# EAGLE design Add-OnV11 (EAGLE 6.3)
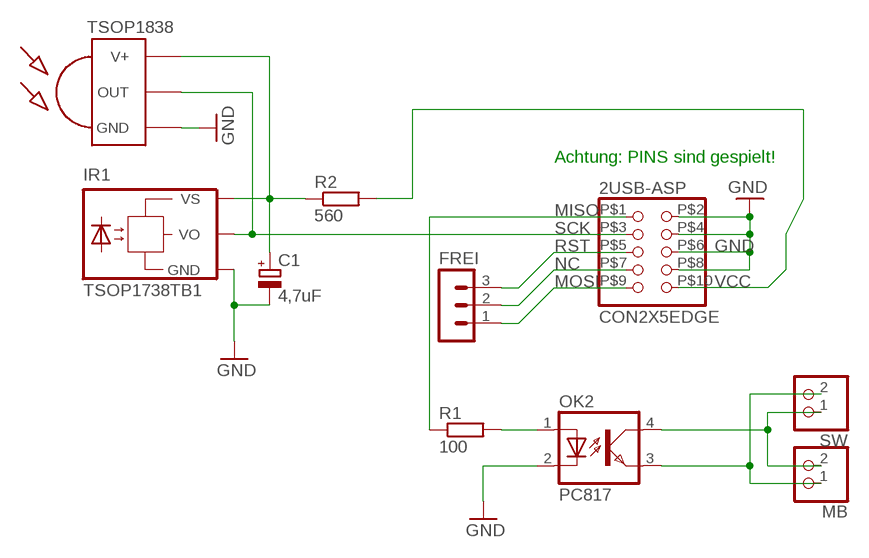
[diagram p0: schematic, sheet 1]

## Parts
2USB-ASP  CON2X5EDGE  [CON2X5EDGE]
C1  4,7uF  CPOL-EUE1.8-4  [E1,8-4]
FREI  MA03-1  [MA03-1]
IR1  TSOP1738TB1  [TSOP17_TB1]
MB  PINHD-1X2  [1X02]
OK2  PC817  [DIL04]
R1  100  R-EU_0204/2V  [0204V]
R2  560  R-EU_0204/2V  [0204V]
SW  PINHD-1X2  [1X02]
U$1  TSOP1838  [TSOP18XX]

## Nets
GND: 2USB-ASP.P$2 2USB-ASP.P$4 2USB-ASP.P$6 2USB-ASP.P$8 C1.- IR1.GND OK2.2(C) U$1.GND
MISO: 2USB-ASP.P$1 R1.1
MOSI: 2USB-ASP.P$9 FREI.1
N$1: C1.+ IR1.VS R2.1 U$1.VCC(V+)
N$2: OK2.1(A) R1.2
N$3: MB.2 OK2.4(COL) SW.1
N$4: MB.1 OK2.3(EMIT) SW.2
NC: 2USB-ASP.P$7 FREI.2
RST: 2USB-ASP.P$5 FREI.3
SCK: 2USB-ASP.P$3 IR1.VO U$1.OUT
VCC: 2USB-ASP.P$10 R2.2

## Notes on the sheet
- Achtung: PINS sind gespielt!

## Library data of the parts
2USB-ASP = schwen:CON2X5EDGE
C1 = rcl:CPOL-EU: POLARIZED CAPACITOR, European symbol
FREI = con-lstb:MA03-1: PIN HEADER; OC_FARNELL: unknown; OC_NEWARK: unknown
IR1 = telefunken:TSOP17*TB1: TSOP17..TB1 IR Receiver Modules for Remote Control Systems Source: http://www.vishay.com/docs/82042/82042.pdf; OC_FARNELL: unknown; OC_NEWARK: unknown
MB SW = pinhead:PINHD-1X2: PIN HEADER
OK2 = optocoupler:PC817: SHARP OPTO COUPLER; MPN: PC817X4J000F; OC_FARNELL: 9707727; OC_NEWARK: 97K7059
R1 R2 = rcl:R-EU_: RESISTOR, European symbol
U$1 = tsop-1:TSOP1838: IR Receiver and Demodulator

## Board
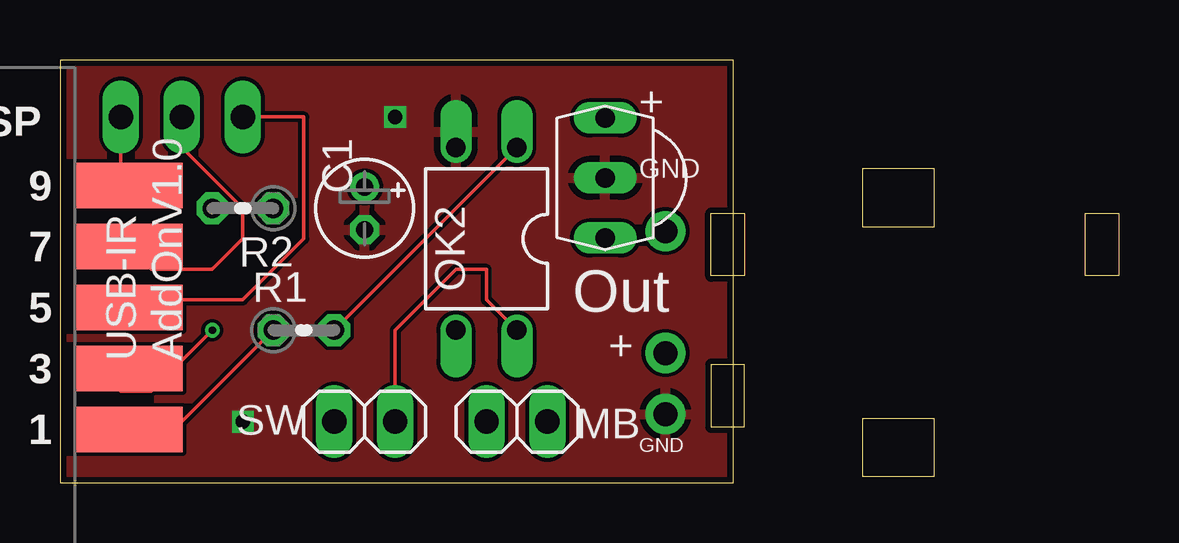
[diagram p1: board, top side]
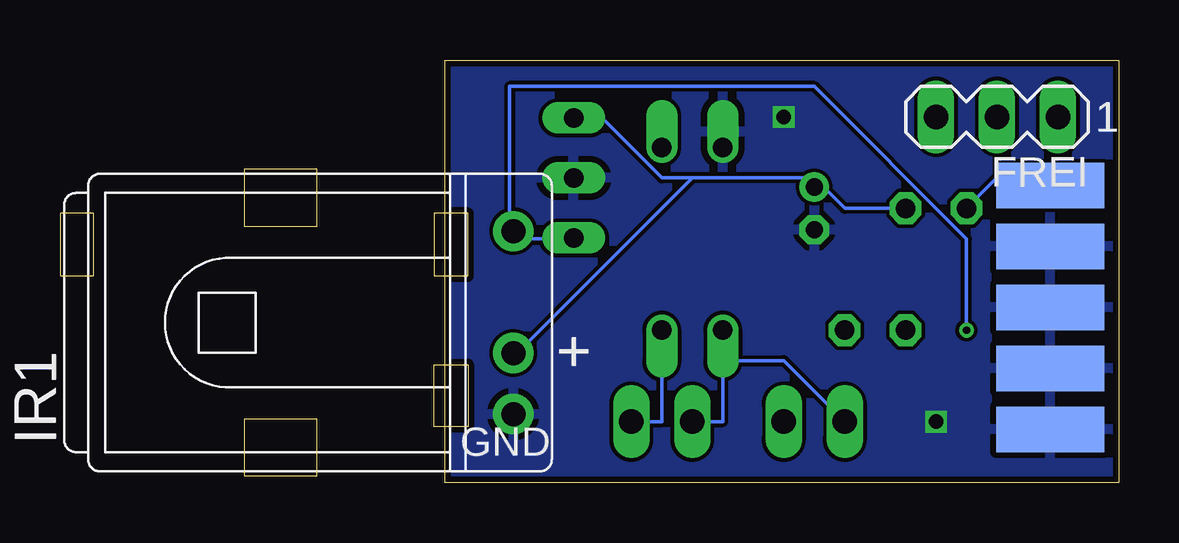
[diagram p2: board, bottom side, seen from below]

Size 28.08 x 17.61 mm. Coordinates in mm from the lower left corner, seen from the top.
Outline: 0,0 28.08,0 28.08,17.61 0,17.61 0,0
Copper layers (1*16): Top 0.035mm / dielectric 1.5mm / Bottom 0.035mm
Design rules "Fusion_eagle_rule_v1.1": minimum track width 6mil, minimum drill 12mil, track to track 6mil, track to pad 6mil, pad to pad 6mil, via to via 6mil, smd to smd 0mil, copper to edge 10mil, drill to drill 10mil, minimum pad ring 10mil, minimum via ring 6mil, stop-mask expansion 2mil, vias tented up to drill 100mil, thermal gap 10mil

### Footprints (pad centres in the part's own frame; a part is rotated, then mirrored left to right if it is on the bottom)
CON2X5EDGE = smd 4.5 x 1.9: P$1 0,5.08; P$3 0,2.54; P$5 0,0; P$7 0,-2.54; P$9 0,-5.08 | smd 4.5 x 1.9 bottom: P$2 0,5.08; P$4 0,2.54; P$6 0,0; P$8 0,-2.54; P$10 0,-5.08
E1,8-4 = drill 0.711 pad 1.168: + -0.889,0 | drill 0.711 pad 1.168 octagon: - 0.889,0
MA03-1 = drill 1.016 long: 1 -2.54,0; 2 0,0; 3 2.54,0
TSOP17_TB1 = drill 1 pad 1.676: GND 0,-3.81; VO 0,3.81; VS 0,-1.27
1X02 = drill 1.016 long: 1 -1.27,0; 2 1.27,0
DIL04 = drill 0.813 offset: 1 -1.27,-3.81; 2 1.27,-3.81; 3 1.27,3.81; 4 -1.27,3.81
0204V = drill 0.813 octagon: 1 -1.27,0; 2 1.27,0
TSOP18XX = drill 0.813 long: GND -0.001,-0.027; OUT -2.501,-0.027; VCC 2.499,-0.027

### Placement (x,y rotation side)
2USB-ASP  2.86,7.3 180 top
C1  12.7,11.43 270 top
FREI  5.08,15.24 180 bottom
IR1  25.24,6.67 0 bottom
MB  19.05,2.54 0 top
OK2  17.78,10.16 180 top
R1  10.16,6.35 0 top
R2  7.62,11.43 180 top
SW  12.7,2.54 180 top
U$1  22.7,12.7 90 top

### Tracks (layer width: path | path; a pad name or v marks a point on that pad's centre or on a via)
GND  (via drill 0.6)
  other vias: 13.97,15.24 7.62,2.54
  pour Bottom: 0,17.78 0,0 27.94,0 27.94,17.78
  pour Top: 0,17.78 27.94,17.78 27.94,0 0,0
MISO
  Top 0.152: R1.1 5.08,2.54 3.81,2.54 2USB-ASP.P$1
MOSI
  Top 0.152: FREI.1 2.54,12.7 2USB-ASP.P$9
N$1
  Bottom 0.152: 12.7,12.7 11.43,11.43 R2.1 | 12.7,12.7 17.78,12.7 | 17.78,12.7 19.05,12.7 21.59,15.24 U$1.VCC | 12.7,12.7 C1.+ | 17.78,12.7 25.4,5.08 IR1.VS
N$2
  Top 0.152: OK2.1 R1.2
N$3
  Top 0.152: SW.1 13.97,6.35 16.51,8.89 17.78,8.89 17.78,7.62 OK2.4
  Bottom 0.152: OK2.4 19.05,2.54 MB.2
N$4
  Bottom 0.152: 16.51,5.08 16.51,2.54 MB.1 | SW.2 13.97,5.08 16.51,5.08 | 16.51,5.08 OK2.3
NC
  Top 0.152: FREI.2 5.08,13.97 7.62,11.43 7.62,10.16 6.35,8.89 3.81,8.89 3.81,10.16 2USB-ASP.P$7
RST
  Top 0.152: FREI.3 10.16,15.24 10.16,10.16 7.62,7.62 3.81,7.62 2USB-ASP.P$5
SCK  (via drill 0.3)
  Top 0.152: v6.35,6.35 3.81,3.81 2.54,3.81 2.54,5.08 2USB-ASP.P$3
  Bottom 0.152: 25.4,10.16 22.86,10.16 U$1.OUT | 25.4,10.16 25.4,16.51 12.7,16.51 6.35,10.16 v6.35,6.35 | 25.4,10.16 IR1.VO
VCC
  Bottom 0.152: R2.2 5.08,12.7 3.81,12.7 2USB-ASP.P$10

### Text on the board
tNames: + | GND | Out | USB-IR / AddOnV1.0 | + | GND
bNames: + | GND